# EAGLE schematic Motor Controller removable maintenance adapter board (EAGLE 7.7.0)
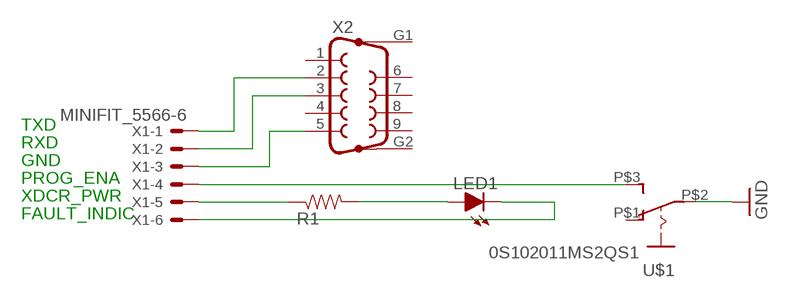
[diagram p0: schematic, sheet 1]

## Parts
LED1  LED-0805  [LED-805]
R1  RESISTOR0805-RES  [0805]
U$1  0S102011MS2QS1  [0S102011MS2QS1]
X1  MINIFIT_5566-6  [MINIFIT_5566-6]
X2  F09HP  [F09HP]

## Nets
GND: U$1.P$2(P)
N$1: LED1.A R1.2
N$2: R1.1 X1.5
N$3: LED1.C X1.6
N$4: U$1.P$3(S) X1.4
N$6: X1.1 X2.2
N$7: X1.2 X2.3
N$8: X1.3 X2.5
Unconnected: U$1.P$1(O) X2.1 X2.4 X2.6 X2.7 X2.8 X2.9 X2.G1 X2.G2

## Notes on the sheet
- TXD
- RXD
- GND
- PROG_ENA
- XDCR_PWR
- FAULT_INDIC

## Library data of the parts
LED1 = HyTechDevices:LED: Light Emitting Diode (LED) Source: Dangerous Prototypes Eagle Library <https://github.com/DangerousPrototypes/Eagle_Part_Library>
R1 = HyTechDevices:RESISTOR: Resistor Basic schematic elements and footprints for 0603, 1206, and PTH resistors.
U$1 = HyTechDevices:0S102011MS2QS1: Slide Switch 0S102011MS2QS1
X1 = HyTechDevices:MINIFIT_5566-6: Mini-Fit Junior connector 6 pole Source: http://www.molex.com; MPN: 95566-61002; OC_FARNELL: unknown; OC_NEWARK: 22K8620
X2 = con-subd:F09HP: SUB-D; OC_FARNELL: unknown; OC_NEWARK: unknown